# EAGLE design 49er (EAGLE 6.5.0)
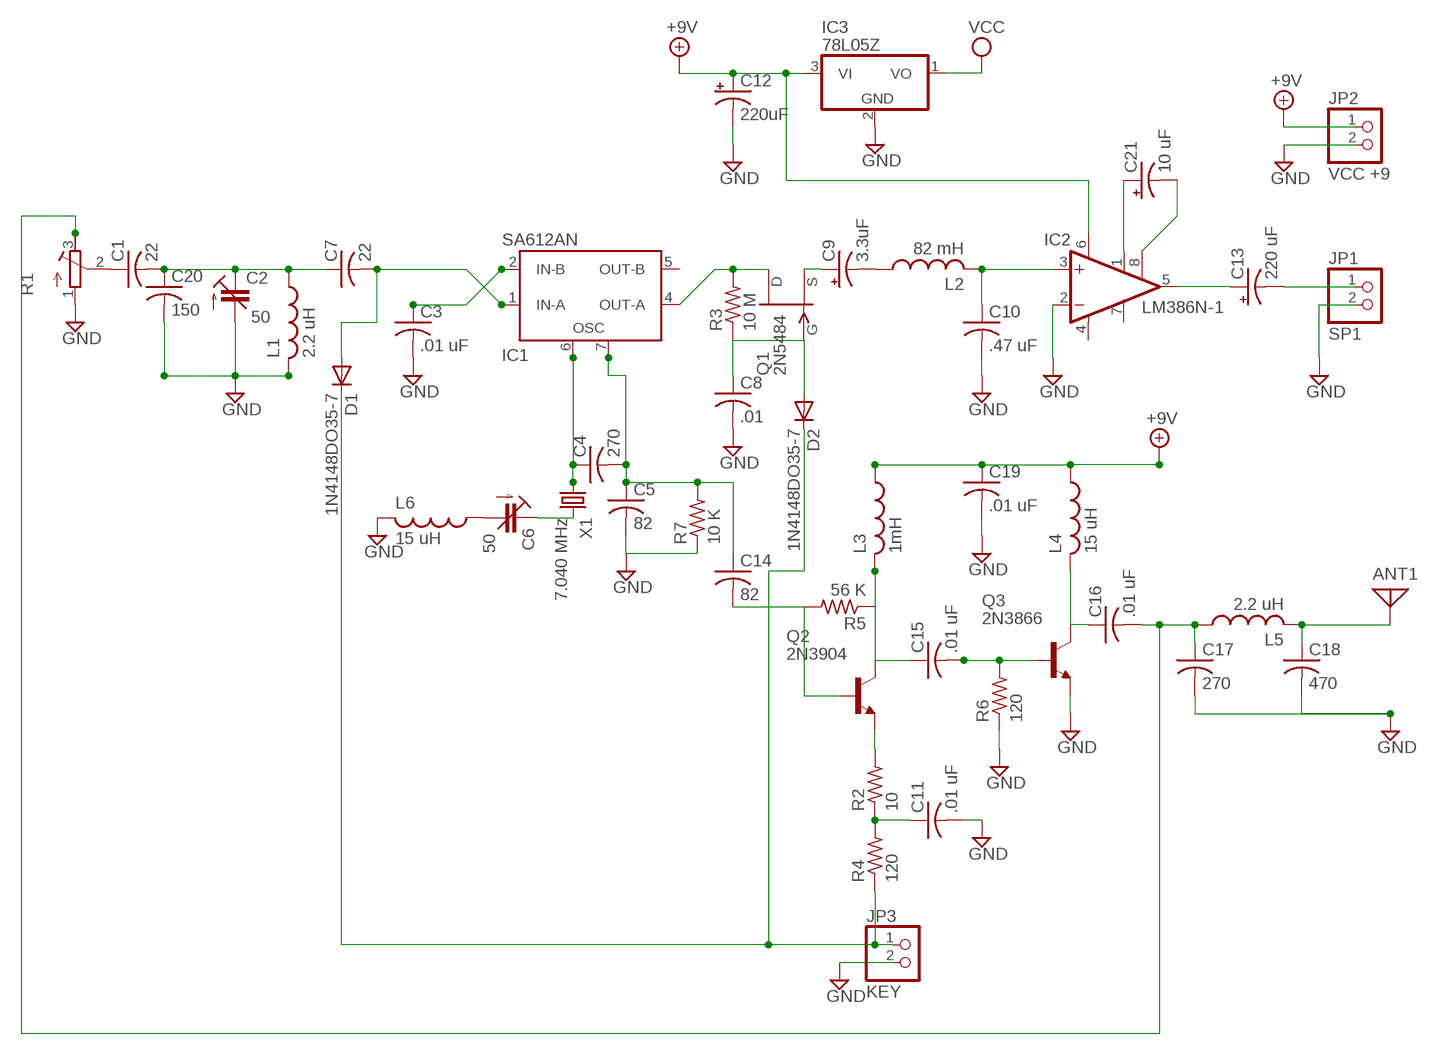
[diagram p0: schematic, sheet 1]

## Parts
ANT1  ANTENNA  [PAD-01]
C1  22  C-US025-025X050  [C025-025X050]
C2  50  C-TRIMM3008  [CTRIM3008]
C3  .01 uF  C-US025-025X050  [C025-025X050]
C4  270  C-US025-025X050  [C025-025X050]
C5  82  C-US025-025X050  [C025-025X050]
C6  50  C-TRIMM3008  [CTRIM3008]
C7  22  C-US025-025X050  [C025-025X050]
C8  .01  C-US025-025X050  [C025-025X050]
C9  3.3uF  CPOL-USE2.5-7  [E2,5-7]
C10  .47 uF  C-US025-025X050  [C025-025X050]
C11  .01 uF  C-US025-025X050  [C025-025X050]
C12  220uF  CPOL-USE2.5-7  [E2,5-7]
C13  220 uF  CPOL-USE2.5-7  [E2,5-7]
C14  82  C-US025-025X050  [C025-025X050]
C15  .01 uF  C-US025-025X050  [C025-025X050]
C16  .01 uF  C-US025-025X050  [C025-025X050]
C17  270  C-US025-025X050  [C025-025X050]
C18  470  C-US025-025X050  [C025-025X050]
C19  .01 uF  C-US025-025X050  [C025-025X050]
C20  150  C-US025-025X050  [C025-025X050]
C21  10 uF  CPOL-USE2.5-7  [E2,5-7]
D1  1N4148DO35-7  [DO35-7]
D2  1N4148DO35-7  [DO35-7]
IC1  SA612AN  [DIL08]
IC2  LM386N-1  [DIL08]
IC3  78L05Z  [TO92]
JP1  SP1  PINHD-1X2  [1X02]
JP2  VCC +9  PINHD-1X2  [1X02]
JP3  KEY  PINHD-1X2  [1X02]
L1  2.2 uH  L-US0207/10  [0207/10]
L2  82 mH  L-USTJ4-U1  [TJ4-U1]
L3  1mH  L-US0207/10  [0207/10]
L4  15 uH  L-US0207/10  [0207/10]
L5  2.2 uH  L-US0207/10  [0207/10]
L6  15 uH  L-US0207/10  [0207/10]
Q1  2N5484  [TO92-]
Q2  2N3904  [TO92]
Q3  2N3866  -NPN-TO92  [TO92]
R1  R-TRIMM3296W  [RTRIM3296W]
R2  10  R-US_0207/10  [0207/10]
R3  10 M  R-US_0207/10  [0207/10]
R4  120  R-US_0207/10  [0207/10]
R5  56 K  R-US_0207/10  [0207/10]
R6  120  R-US_0207/10  [0207/10]
R7  10 K  R-US_0207/10  [0207/10]
X1  7.040 MHz  CRYSTALHC49S  [HC49/S]

## Nets
+9V: C12.+ C19.1 IC2.6(VS) IC3.3(VI) JP2.1 L3.1 L4.1
GND: C2.-(A) C3.2 C5.2 C8.2 C10.2 C11.2 C12.- C17.2 C18.2 C19.2 C20.2 IC2.2(-IN) IC3.2(GND) JP1.2 JP2.2 JP3.2 L1.2 L6.2 Q3.1(E) R1.1(E) R6.1 R7.1
N$1: D1.C D2.C JP3.1 R4.1
N$2: C1.1 R1.2(S)
N$3: C1.2 C2.+(E) C7.1 C20.1 L1.1
N$4: C3.1 IC1.2(IN-B)
N$5: C4.2 C5.1 C14.1 IC1.7(OSC') R7.2
N$7: C7.2 D1.A IC1.1(IN-A)
N$8: C6.+(E) X1.2
N$9: C4.1 IC1.6(OSC) X1.1
N$10: C9.- L2.1
N$11: C6.-(A) L6.1
N$12: IC1.4(OUT-A) Q1.3(D) R3.2
N$13: C9.+ Q1.2(S)
N$14: C8.1 D2.A Q1.1(G) R3.1
N$15: C10.1 IC2.3(+IN) L2.2
N$16: C13.- JP1.1
N$17: C13.+ IC2.5(OUT)
N$18: C21.+ IC2.1(GAIN)
N$19: C21.- IC2.8(GAIN)
N$20: C16.1 L4.2 Q3.3(C)
N$21: C16.2 C17.1 L5.1 R1.3(A)
N$22: ANT1.1 C18.1 L5.2
N$23: C14.2 Q2.2(B) R5.2
N$24: C15.2 Q3.2(B) R6.2
N$25: C15.1 L3.2 Q2.1(C) R5.1
N$26: Q2.3(E) R2.2
N$27: C11.1 R2.1 R4.2
VCC: IC3.1(VO)
Unconnected: IC1.5(OUT-B) IC2.7(BYPASS)

## Power pins joined to a net without a drawn wire
GND: IC1.3(GND) IC2.4(GND)
VCC: IC1.8(VCC)

## Library data of the parts
ANT1 = discrete:ANTENNA: Antenna
C1 C3-C5 C7 C8 C10 C11 C14-C20 = resistor:C-US: CAPACITOR, American symbol
C2 C6 = resistor:C-TRIMM: Trimm capacitor
C9 C12 C13 C21 = resistor:CPOL-US: POLARIZED CAPACITOR, American symbol
D1 D2 = diode:1N4148: DIODE high speed (Philips)
IC1 = linear:SA612A: Double-balanced mixer and oscillator NE612/SA612 Source: www-eu2.semiconductors.philips.com/acrobat/datasheets/SA612A.pdf
IC2 = linear:LM386?-*: Low Voltage Audio Power Amplifier Source: http://cache.national.com/ds/LM/LM386.pdf
IC3 = linear:78*: Positive VOLTAGE REGULATOR Source: http://cache.national.com/ds/LM/LM78L05.pdf http://www.fairchildsemi.com/ds/LM/LM7805.pdf
JP1-JP3 = pinhead:PINHD-1X2: PIN HEADER
L1-L6 = resistor:L-US: INDUCTOR, American symbol
Q1 = transistor-fet:?548*: N-Channel JFETs Source: VISHAY 2N5484.pdf Compatible: TO92 2N5245 J304 J305 U310 J308 J309 J310 TO72 2N4416 2N4416A 2N3823 2N4351 3N169 3N170 3N171 MFE3002 TO18 2N3796 2N3797 MFE825 Source: Motorola European Master Guide Pacge 3-59
Q2 = transistor:2N3904: NPN TRANSISTOR
Q3 = transistor:*-NPN-: NPN Transistror BF959 corrected 2008.03.06
R1 = resistor:R-TRIMM: Trimm resistor
R2-R7 = resistor:R-US_: RESISTOR, American symbol
X1 = crystal:CRYSTAL: CRYSTAL; OC_FARNELL: 1667008; OC_NEWARK: unknown

## Net classes
0 default: width 0.406 mm

## Board
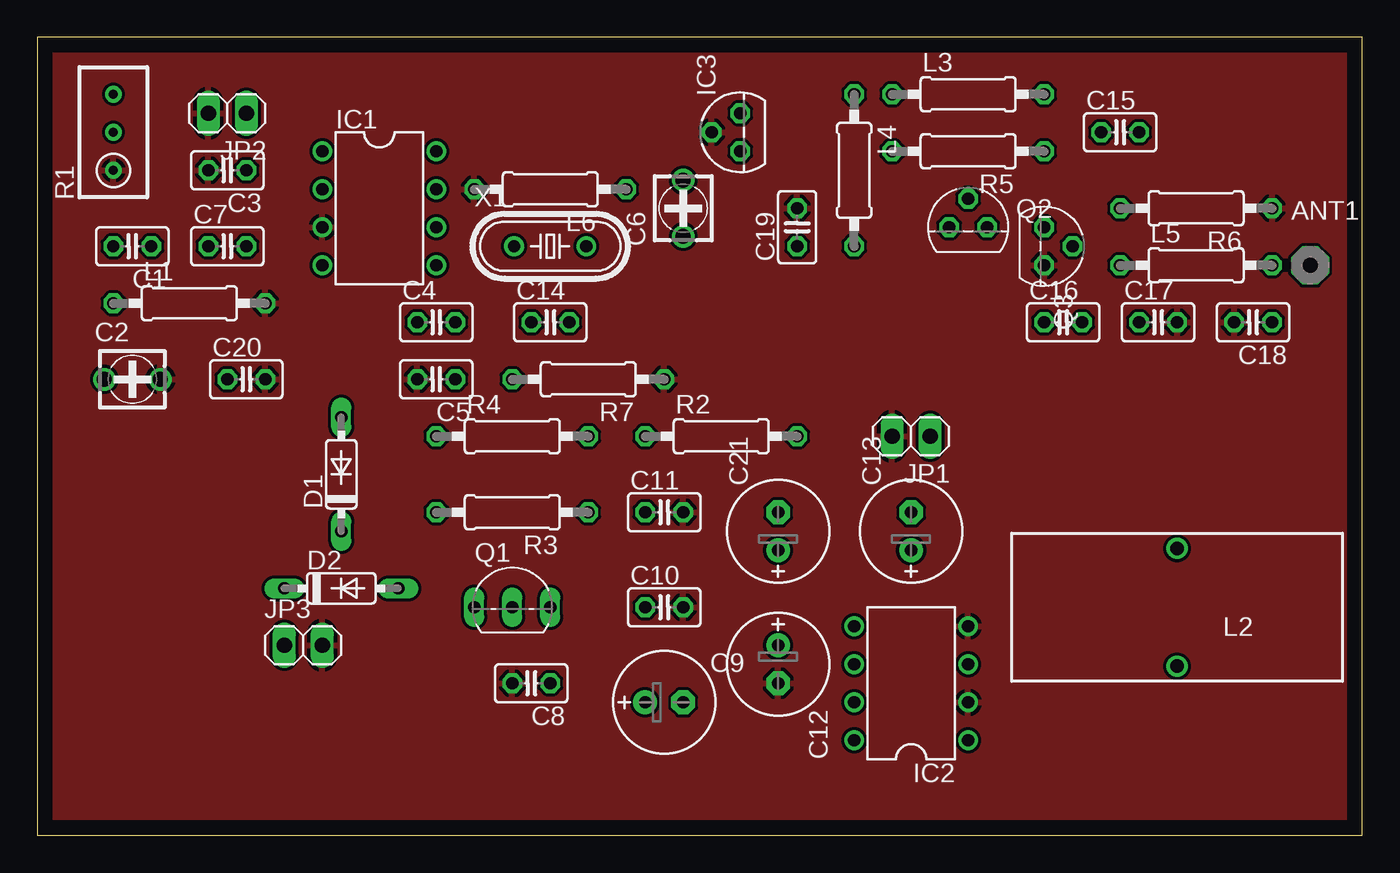
[diagram p1: board, top side]
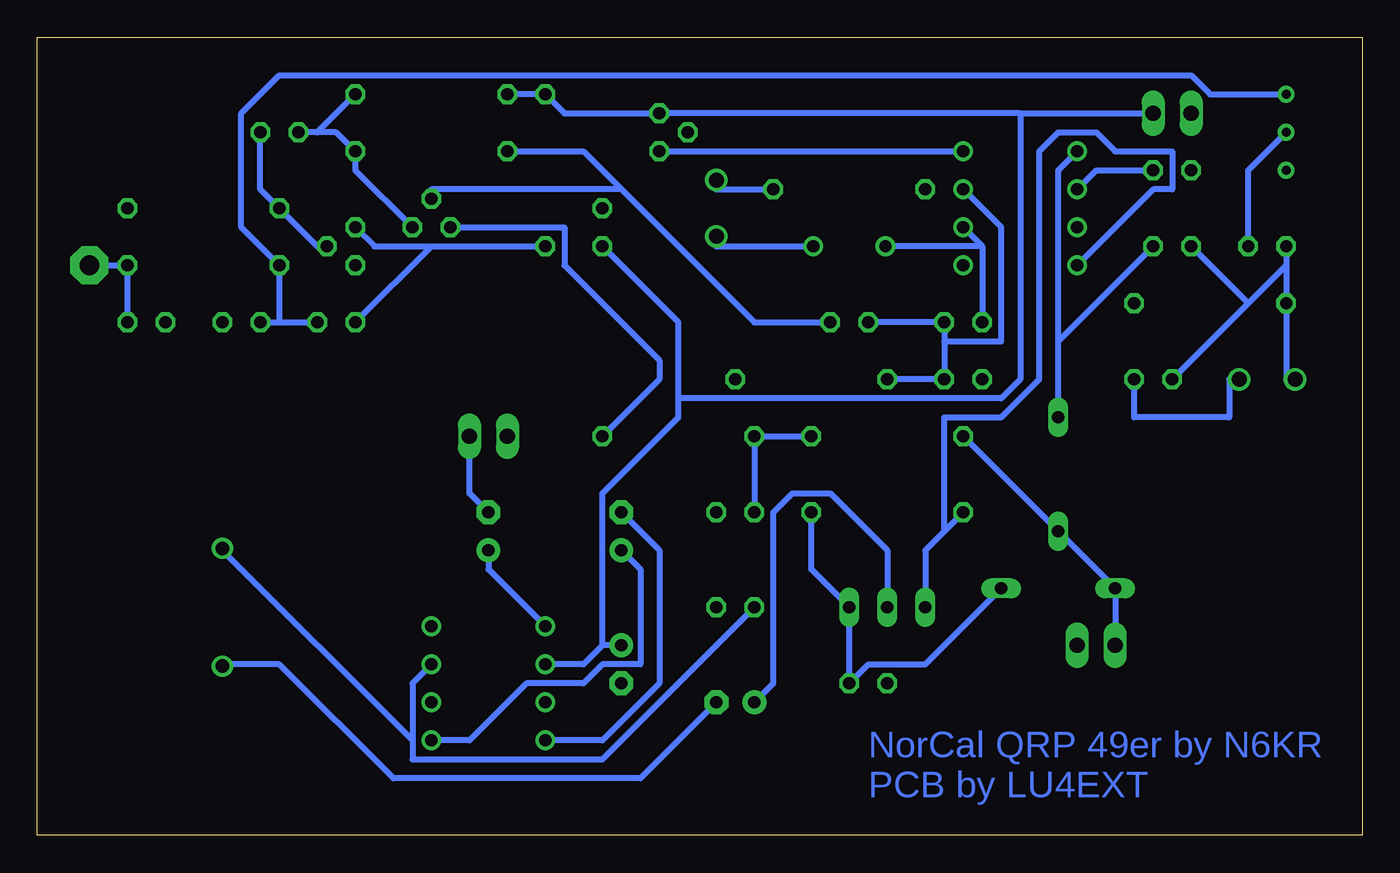
[diagram p2: board, bottom side, seen from below]

Size 88.57 x 53.33 mm. Coordinates in mm from the lower left corner, seen from the top.
Outline: 0,0 88.57,0 88.57,53.33 0,53.33 0,0
Copper layers (1*16): Top 0.035mm / dielectric 1.5mm / Bottom 0.035mm
Design rules "default": minimum track width 10mil, minimum drill 24mil, track to track 8mil, track to pad 8mil, pad to pad 8mil, via to via 8mil, smd to smd 8mil, copper to edge 40mil, drill to drill 8mil, minimum pad ring 10mil, minimum via ring 8mil, stop-mask expansion 4mil, vias tented up to drill 0mil, thermal gap 10mil

### Footprints (pad centres in the part's own frame; a part is rotated, then mirrored left to right if it is on the bottom)
PAD-01 = drill 1.321 pad 2.54 octagon: 1 0,0
C025-025X050 = drill 0.813 octagon: 1 -1.27,0; 2 1.27,0
CTRIM3008 = drill 1: + -1.875,0; - 1.875,0
E2,5-7 = drill 0.813 pad 1.6: + -1.27,0 | drill 0.813 pad 1.6 octagon: - 1.27,0
DO35-7 = drill 0.813 long: A 3.81,0; C -3.81,0
DIL08 = drill 0.813 pad 1.27: 1 -3.81,-3.81; 2 -1.27,-3.81; 3 1.27,-3.81; 4 3.81,-3.81; 5 3.81,3.81; 6 1.27,3.81; 7 -1.27,3.81; 8 -3.81,3.81
TO92 = drill 0.813 octagon: 1 -1.27,0; 2 0,1.905; 3 1.27,0
1X02 = drill 1.016 long: 1 -1.27,0; 2 1.27,0
0207/10 = drill 0.813 octagon: 1 -5.08,0; 2 5.08,0
TJ4-U1 = drill 0.9: 1 -3.935,0; 2 3.935,0
TO92- = drill 0.813 long: 1 2.54,0; 2 0,0; 3 -2.54,0
TO92' = drill 0.813 octagon: 1 1.27,0; 2 0,1.905; 3 -1.27,0
RTRIM3296W = drill 0.61: 1 0,-2.54; 2 0,0; 3 0,2.54
HC49/S = drill 0.813: 1 -2.413,0; 2 2.413,0

### Placement (x,y rotation side)
ANT1  85.09,38.1 0 top
C1  6.35,39.37 180 top
C2  6.35,30.48 0 top
C3  12.7,44.45 180 top
C4  26.67,34.29 0 top
C5  26.67,30.48 180 top
C6  43.18,41.91 90 top
C7  12.7,39.37 0 top
C8  33.02,10.16 180 top
C9  41.91,8.89 0 top
C10  41.91,15.24 0 top
C11  41.91,21.59 0 top
C12  49.53,11.43 270 top
C13  58.42,20.32 90 top
C14  34.29,34.29 0 top
C15  72.39,46.99 0 top
C16  68.58,34.29 0 top
C17  74.93,34.29 0 top
C18  81.28,34.29 180 top
C19  50.8,40.64 90 top
C20  13.97,30.48 0 top
C21  49.53,20.32 90 top
D1  20.32,24.13 90 top
D2  20.32,16.51 0 top
IC1  22.86,41.91 270 top
IC2  58.42,10.16 90 top
IC3  46.99,46.99 90 top
JP1  58.42,26.67 180 top
JP2  12.7,48.26 180 top
JP3  17.78,12.7 0 top
L1  10.16,35.56 0 top
L2  76.2,15.24 90 top
L3  62.23,49.53 0 top
L4  54.61,44.45 270 top
L5  77.47,38.1 0 top
L6  34.29,43.18 180 top
Q1  31.75,15.24 0 top
Q2  2N3904  [TO92']  62.23,40.64 0 top
Q3  2N3866  [TO92']  67.31,39.37 270 top
R1  5.08,46.99 0 top
R2  45.72,26.67 0 top
R3  31.75,21.59 180 top
R4  31.75,26.67 0 top
R5  62.23,45.72 180 top
R6  77.47,41.91 180 top
R7  36.83,30.48 180 top
X1  34.29,39.37 0 top

### Tracks (layer width: path | path; a pad name or v marks a point on that pad's centre or on a via)
+9V
  Bottom 0.406: IC2.6 52.07,11.43 50.8,12.7 | C12.+ 50.8,12.7 | C19.1 45.72,34.29 45.72,29.21 | 45.72,29.21 45.72,27.94 50.8,22.86 50.8,12.7 | L3.1 L4.1 53.34,48.26 IC3.3 22.86,48.26 | 22.86,48.26 JP2.1 | 45.72,29.21 24.13,29.21 22.86,30.48 22.86,48.26
GND
  Bottom 0.406: 8.89,30.48 8.89,27.94 15.24,27.94 C20.2
  pour Top: 0,53.34 88.9,53.34 88.9,0 0,0 0,1.27
N$1
  Bottom 0.406: R4.1 D1.C D2.C JP3.1
N$2
  Bottom 0.406: R1.2 7.62,44.45 C1.1
N$3
  Bottom 0.406: C1.2 5.08,38.1 | 5.08,38.1 L1.1 5.08,30.48 C2.+ | 5.08,38.1 7.62,35.56 | 7.62,35.56 C20.1 | 7.62,35.56 C7.1
N$4
  Bottom 0.406: C3.1 17.78,44.45 IC1.2
N$5
  Bottom 0.406: 27.94,33.02 C4.2 C14.1 | 27.94,33.02 C5.1 R7.2 | IC1.7 24.13,40.64 24.13,33.02 27.94,33.02
N$7
  Bottom 0.406: IC1.1 20.32,44.45 20.32,33.02 | D1.A 20.32,33.02 | 20.32,33.02 C7.2
N$8
  Bottom 0.406: X1.2 43.18,39.37 C6.+
N$9
  Bottom 0.406: 25.4,39.37 C4.1 | IC1.6 25.4,39.37 | 25.4,39.37 X1.1
N$10
  Bottom 0.406: C9.- 48.26,3.81 64.77,3.81 72.39,11.43 76.2,11.43 L2.1
N$11
  Bottom 0.406: L6.1 43.18,43.18 C6.-
N$12
  Bottom 0.406: Q1.3 29.21,19.05 27.94,20.32 | R3.2 27.94,20.32 | IC1.4 13.97,43.18 12.7,43.18 12.7,45.72 16.51,45.72 17.78,46.99 20.32,46.99 21.59,45.72 21.59,30.48 24.13,27.94 27.94,27.94 27.94,20.32
N$13
  Bottom 0.406: Q1.2 31.75,19.05 35.56,22.86 38.1,22.86 39.37,21.59 39.37,10.16 C9.+
N$14
  Bottom 0.406: R3.1 36.83,17.78 Q1.1 C8.1 33.02,11.43 29.21,11.43 D2.A
N$15
  Bottom 0.406: C10.1 50.8,5.08 63.5,5.08 63.5,6.35 | 63.5,6.35 63.5,10.16 IC2.3 | 63.5,6.35 76.2,19.05 L2.2
N$16
  Bottom 0.406: JP1.1 59.69,22.86 C13.-
N$17
  Bottom 0.406: IC2.5 58.42,17.78 C13.+
N$18
  Bottom 0.406: IC2.1 59.69,6.35 55.88,10.16 52.07,10.16 50.8,11.43 48.26,11.43 48.26,17.78 C21.+
N$19
  Bottom 0.406: IC2.8 50.8,6.35 46.99,10.16 46.99,19.05 C21.-
N$20
  Bottom 0.406: 62.23,39.37 66.04,39.37 Q3.3 | 62.23,39.37 L4.2 | 62.23,39.37 C16.1
N$21
  Bottom 0.406: R1.3 10.16,49.53 11.43,50.8 72.39,50.8 74.93,48.26 74.93,40.64 L5.1 72.39,34.29 | C17.1 72.39,34.29 | 72.39,34.29 C16.2
N$22
  Bottom 0.406: ANT1.1 L5.2 C18.1
N$23
  Bottom 0.406: C14.2 40.64,34.29 49.53,43.18 | 49.53,43.18 52.07,45.72 R5.2 | 49.53,43.18 62.23,43.18 Q2.2
N$24
  Bottom 0.406: Q3.2 69.85,39.37 R6.2 73.66,43.18 C15.2
N$25
  Bottom 0.406: Q2.1 67.31,44.45 R5.1 68.58,46.99 69.85,46.99 | 69.85,46.99 C15.1 | 69.85,46.99 L3.2
N$26
  Bottom 0.406: R2.2 46.99,30.48 46.99,31.75 53.34,38.1 53.34,40.64 Q2.3
N$27
  Bottom 0.406: R4.2 R2.1 C11.1
VCC
  Bottom 0.406: IC3.1 IC1.8

### Text on the board
Bottom: NorCal QRP 49er by N6KR / PCB by LU4EXT